# Altium schematic sheet 电源.SchDoc
size A4
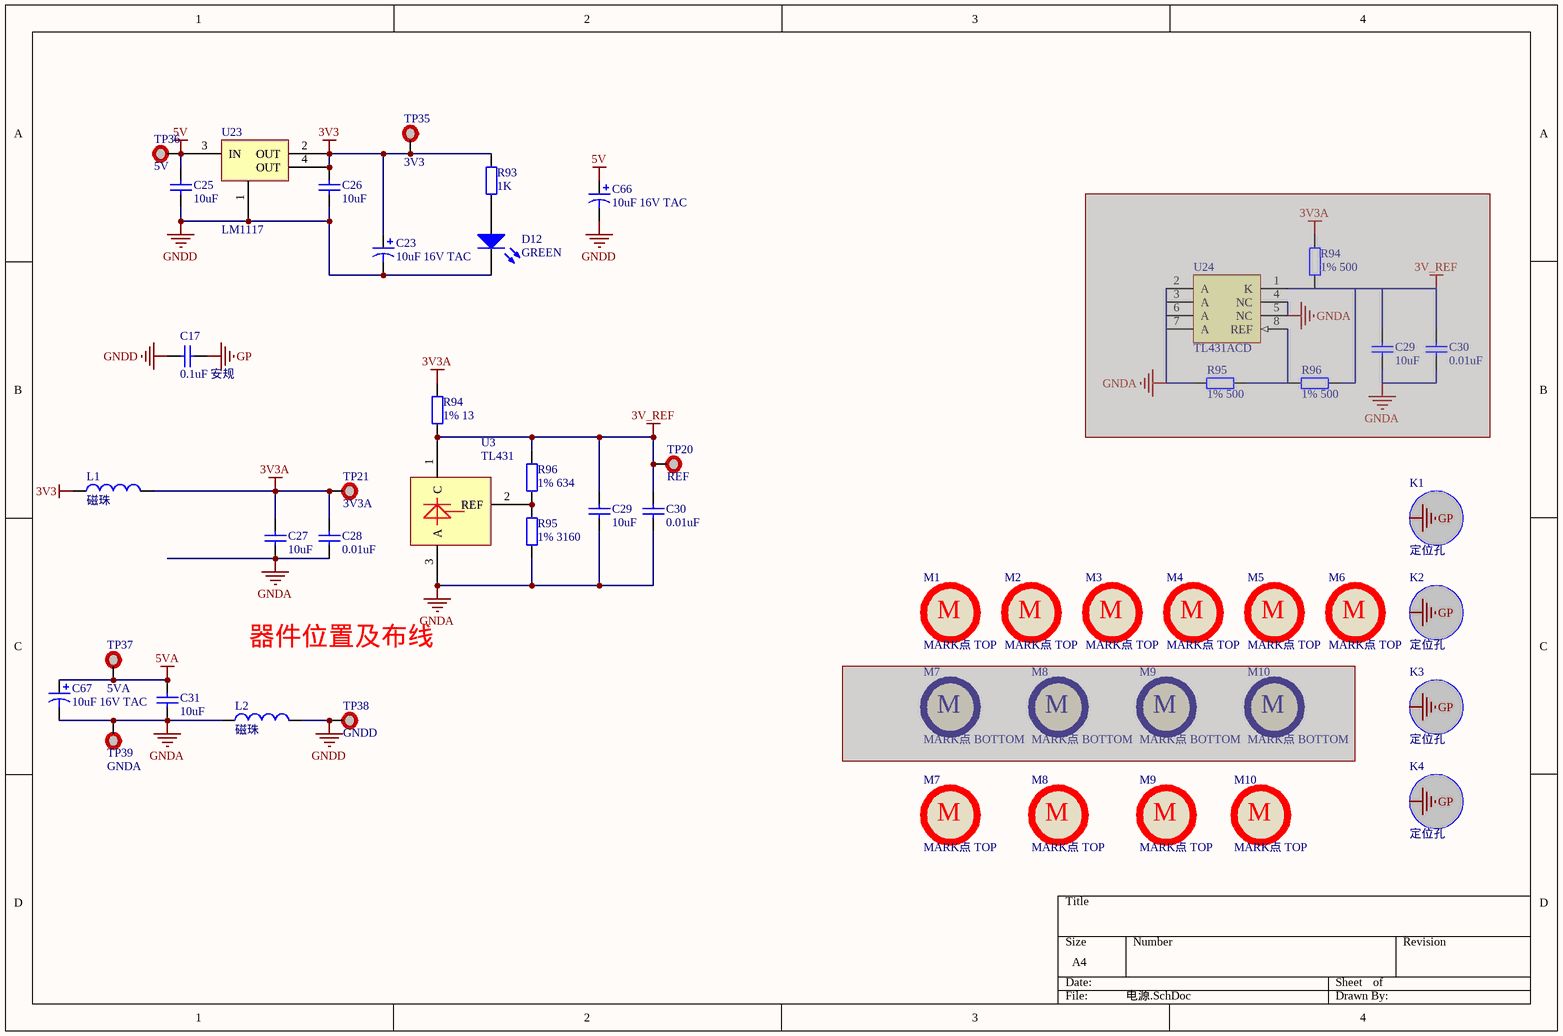
[diagram p0: 电源.SchDoc]

## Parts
(Parts that share a designator on the sheet are numbered #1, #2 ... from top to bottom, then left to right.)
C17  0.1uF 安规  [安规电容 10mm间距]
C23  10uF 16V TAC  [3216TAC]
C25  10uF  [C SMD 1206]
C26  10uF  [C SMD 1206]
C27  10uF  [C SMD 1206]
C28  0.01uF  [C SMD 0603]
C29#1  10uF  [C SMD 1206]  (masked out: inside a compile mask, not in the netlist)
C29#2  10uF  [C SMD 1206]
C30#1  0.01uF  [C SMD 0603]  (masked out: inside a compile mask, not in the netlist)
C30#2  0.01uF  [C SMD 0603]
C31  10uF  [C SMD 1206]
C66  10uF 16V TAC  [3216TAC]
C67  10uF 16V TAC  [3216TAC]
D12  GREEN  [LED SMD 0805]
K1  定位孔  [定位孔]
K2  定位孔  [定位孔]
K3  定位孔  [定位孔]
K4  定位孔  [定位孔]
L1  磁珠  [L SMD 1206]
L2  磁珠  [L SMD 1206]
M1  MARK点 TOP  [MARK点 TOP]
M2  MARK点 TOP  [MARK点 TOP]
M3  MARK点 TOP  [MARK点 TOP]
M4  MARK点 TOP  [MARK点 TOP]
M5  MARK点 TOP  [MARK点 TOP]
M6  MARK点 TOP  [MARK点 TOP]
M7#1  MARK点 BOTTOM  [MARK点 BOTTOM]  (masked out: inside a compile mask, not in the netlist)
M7#2  MARK点 TOP  [MARK点 TOP]
M8#1  MARK点 BOTTOM  [MARK点 BOTTOM]  (masked out: inside a compile mask, not in the netlist)
M8#2  MARK点 TOP  [MARK点 TOP]
M9#1  MARK点 BOTTOM  [MARK点 BOTTOM]  (masked out: inside a compile mask, not in the netlist)
M9#2  MARK点 TOP  [MARK点 TOP]
M10#1  MARK点 BOTTOM  [MARK点 BOTTOM]  (masked out: inside a compile mask, not in the netlist)
M10#2  MARK点 TOP  [MARK点 TOP]
R93  1K  [R SMD 0603]
R94#1  1% 500  [R SMD 0603]  (masked out: inside a compile mask, not in the netlist)
R94#2  1% 13  [R SMD 0603 1%]
R95#1  1% 500  [R SMD 0603]  (masked out: inside a compile mask, not in the netlist)
R95#2  1% 3160  [R SMD 0603 1%]
R96#1  1% 500  [R SMD 0603]  (masked out: inside a compile mask, not in the netlist)
R96#2  1% 634  [R SMD 0603 1%]
TP20  REF  [测点]
TP21  3V3A  [测点]
TP35  3V3  [测点]
TP36  5V  [测点]
TP37  5VA  [测点]
TP38  GNDD  [测点 地]
TP39  GNDA  [测点 地]
U3  TL431  [SOT23]
U23  LM1117
U24  TL431ACD  [NSO8_N]  (masked out: inside a compile mask, not in the netlist)

## Nets
3V3: C23.1 C26.2 L1.1 R93.1 TP35.1 U23.2(OUT) U23.4(OUT)
3V3A: C27.2 C28.2 L1.2 R94#2.1 TP21.1
3V_REF: C29#2.2 C30#2.2 R94#2.2 R96#2.1 TP20.1 U3.1(C)
5V: C25.2 C66.1 TP36.1 U23.3(IN)
5VA: C31.2 C67.1 TP37.1
GNDA: C27.1 C28.1 C29#2.1 C30#2.1 C31.1 C67.2 L2.1 R95#2.1 TP39.1 U3.3(A)
GNDD: C17.2 C23.2 C25.1 C26.1 C66.2 D12.2(K) L2.2 TP38.1 U23.1(GND)
GP: C17.1 K1.1 K2.1 K3.1 K4.1
NetD12_1: D12.1(A) R93.2
NetR95#2_2: R95#2.2 R96#2.2 U3.2(REF)

Not connected (* = marked no-connect by the designer): M1 1; M2 1; M3 1; M4 1; M5 1; M6 1; M7#2 1; M8#2 1; M9#2 1; M10#2 1

## Notes on the sheet
- 器件位置及布线
- (in symbol MARK点 BOTTO) M
- (in symbol MARK点 TO) M

## Library data of the parts
C17 = Cap: Capacitor; Published: 8-Jun-2000; LatestRevisionDate: 17-Jul-2002; LatestRevisionNote: Re-released for DXP Platform.; PackageReference: RAD-0.3; Publisher: Altium Limited; PackageDescription: Radial Cap, Thru-Hole; 2 Leads; 0.3 in Pin Spacing; Value: 0.1uF
C23 C66 C67 = Cap Pol1: Polarized Capacitor (Radial); Value: 100uF10VALC; Published: 8-Jun-2000; LatestRevisionDate: 17-Jul-2002; LatestRevisionNote: Re-released for DXP Platform.; PackageReference: RB7.6-15; Publisher: Altium Limited
C25-C28 C29#1 C29#2 C30#1 C30#2 C31 = Cap: Capacitor; Value: 0.1uF; Published: 8-Jun-2000; LatestRevisionDate: 17-Jul-2002; LatestRevisionNote: Re-released for DXP Platform.; PackageReference: RAD-0.3; Publisher: Altium Limited; PackageDescription: Radial Cap, Thru-Hole; 2 Leads; 0.3 in Pin Spacing
D12 = LED1: Typical RED GaAs LED; Published: 8-Jun-2000; LatestRevisionDate: 08-Jul-2005; LatestRevisionNote: Mech Layer 1 removed.; PackageReference: LED-1; Publisher: Altium Limited; PackageDescription: LED; 2 Leads
L1 L2 = Inductor: Code_IEC: 1005; Value: 10mH; Published: 8-Jun-2000; LatestRevisionDate: 29-May-2009; LatestRevisionNote: IPC-7351 Footprint Added.; PackageReference: 0402-A; Publisher: Altium Limited; PackageDescription: Chip Inductor; Code_JEITA: 0402
M1-M6 M7#2 M8#2 M9#2 M10#2 = MARK点 TO
M7#1 M8#1 M9#1 M10#1 = MARK点 BOTTO
R93 = Res2: Resistor; Value: 10K; Published: 8-Jun-2000; LatestRevisionDate: 17-Jul-2002; LatestRevisionNote: Re-released for DXP Platform.; PackageReference: AXIAL-0.4; Publisher: Altium Limited
R94#1 R94#2 R95#1 R95#2 R96#1 R96#2 = Res2: Resistor; Value: Rx; Published: 8-Jun-2000; LatestRevisionDate: 17-Jul-2002; LatestRevisionNote: Re-released for DXP Platform.; PackageReference: AXIAL-0.4; Publisher: Altium Limited
TP20 TP21 TP35-TP39 = TEST_POINT
U24 = TL431ACD: Programmable Voltage Reference; Published: 24-Aug-2001; LatestRevisionDate: 13-Apr-2006; LatestRevisionNote: IPC-7351 Footprint Added.; DatasheetVersion: Nov-1998; PackageVersion: Dec-2002; PackageReference: SO8; Publisher: Altium Limited; PackageDescription: 8-Pin Small Outline Integrated Circuit 1.27 mm Pitch; Code_JEDEC: MS-012-AA; Code_IPC: SOIC127P600-8; ComponentLink1Description: Manufacturer Link; ComponentLink1URL: http://www.st.com/; ComponentLink2Description: Datasheet; ComponentLink2URL: http://www.st.com/stonline/products/literature/ds/4467/tl431.pdf